# Altium schematic sheet SDIO_SD_CARD.SchDoc
size A4; SheetNumber: 5; SheetTotal: 6
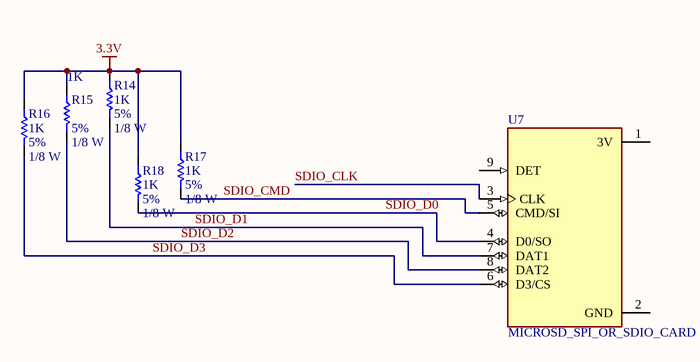
[diagram p0: SDIO_SD_CARD.SchDoc]

## Parts
R14  Tolerance: 5%  Power: 1/8 W  [RES 0805 (2012X06L)]  (hidden comment: 1K)
R15  Tolerance: 5%  Power: 1/8 W  [RES 0805 (2012X06L)]  (hidden comment: 1K)
R16  Tolerance: 5%  Power: 1/8 W  [RES 0805 (2012X06L)]  (hidden comment: 1K)
R17  Tolerance: 5%  Power: 1/8 W  [RES 0805 (2012X06L)]  (hidden comment: 1K)
R18  Tolerance: 5%  Power: 1/8 W  [RES 0805 (2012X06L)]  (hidden comment: 1K)
U7  MICROSD_SPI_OR_SDIO_CARD  [MODULE_MICROSD_SPI_OR_SDIO_CARD]

## Nets
3.3V: R14.1 R15.1 R16.1 R17.1 R18.1
SDIO_CLK: U7.3(CLK)
SDIO_CMD: R17.2 U7.5(CMD/SI)
SDIO_D0: R18.2 U7.4(D0/SO)
SDIO_D1: R14.2 U7.7(DAT1)
SDIO_D2: R15.2 U7.8(DAT2)
SDIO_D3: R16.2 U7.6(D3/CS)

Not connected (* = marked no-connect by the designer): U7 1(3V) 2(GND) 9(DET)

## Library data of the parts
R14-R18 = Resistor: Value: 1K
U7 = MICROSD_SPI_OR_SDIO_CARD: Memory Card Connectors Raspberry pi microSD card adapter; MF: Adafruit Industries; MP: MicroSD SPI or SDIO Card; SnapEDA_Link: https://www.snapeda.com/parts/MicroSD%20SPI%20or%20SDIO%20Card/Adafruit+Industries/view-part/?ref=snap; Package: Package; Value: *; Check_prices: https://www.snapeda.com/parts/MicroSD%20SPI%20or%20SDIO%20Card/Adafruit+Industries/view-part/?ref=eda